# EAGLE schematic nano (EAGLE 7.4.0)
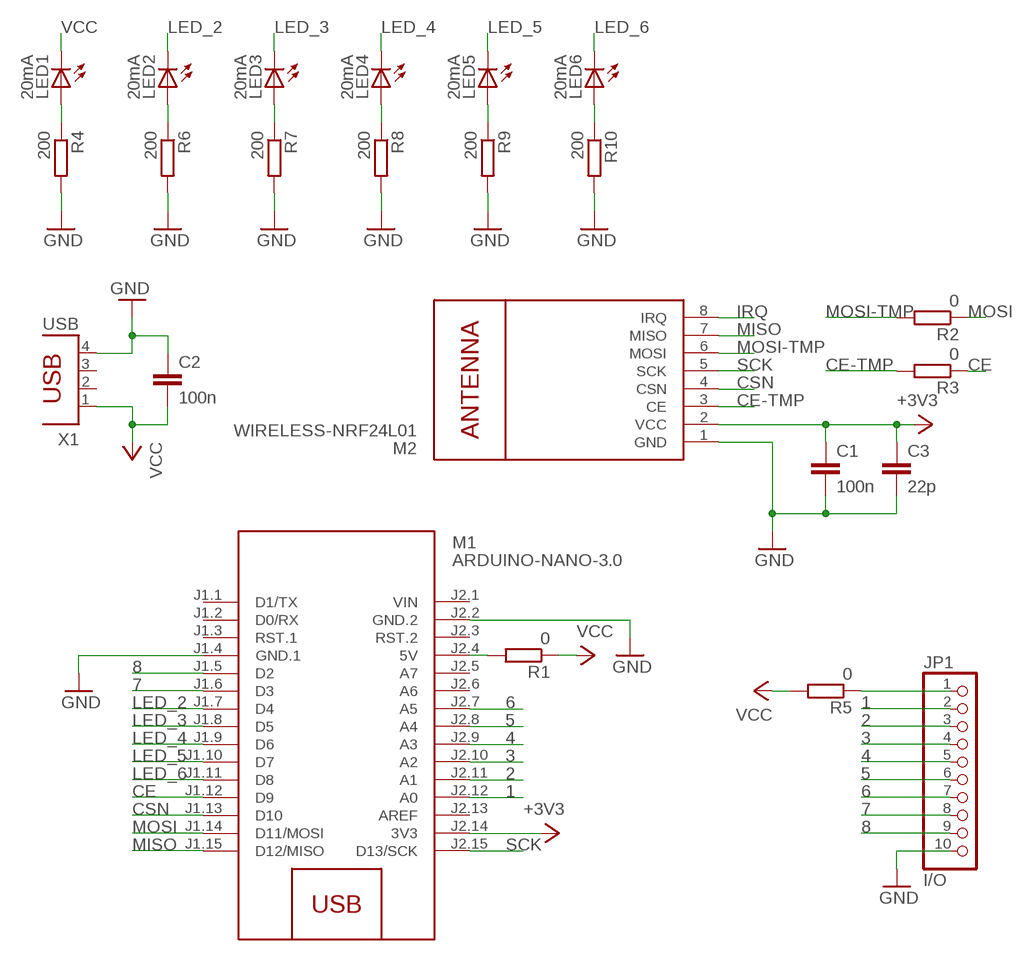
[diagram p0: schematic, sheet 1]

## Parts
C1  100n  C-EUC1206  [C1206]
C2  100n  C-EUC1206  [C1206]
C3  22p  C-EUC1206  [C1206]
JP1  I/O  PINHD-1X10  [1X10]
LED1  20mA  LEDCHIPLED_1206  [CHIPLED_1206]
LED2  20mA  LEDCHIPLED_1206  [CHIPLED_1206]
LED3  20mA  LEDCHIPLED_1206  [CHIPLED_1206]
LED4  20mA  LEDCHIPLED_1206  [CHIPLED_1206]
LED5  20mA  LEDCHIPLED_1206  [CHIPLED_1206]
LED6  20mA  LEDCHIPLED_1206  [CHIPLED_1206]
M1  ARDUINO-NANO-3.0  [ARDUINO-NANO-3.0]
M2  WIRELESS-NRF24L01  [WIRELESS-NRF24L01]
R1  0  R-EU_R1206  [R1206]
R2  0  R-EU_R1206  [R1206]
R3  0  R-EU_R1206  [R1206]
R4  200  R-EU_R1206  [R1206]
R5  0  R-EU_R1206  [R1206]
R6  200  R-EU_R1206  [R1206]
R7  200  R-EU_R1206  [R1206]
R8  200  R-EU_R1206  [R1206]
R9  200  R-EU_R1206  [R1206]
R10  200  R-EU_R1206  [R1206]
X1  USB  PN87520  [PN87520]

## Nets
1: JP1.2 M1.J2.12(A0)
2: JP1.3 M1.J2.11(A1)
3: JP1.4 M1.J2.10(A2)
4: JP1.5 M1.J2.9(A3)
5: JP1.6 M1.J2.8(A4)
6: JP1.7 M1.J2.7(A5)
7: JP1.8 M1.J1.6(D3)
8: JP1.9 M1.J1.5(D2)
+3V3: C1.1 C3.1 M1.J2.14(3V3) M2.2(VCC)
CE: M1.J1.12(D9) R3.1
CE-TMP: M2.3(CE) R3.2
CSN: M1.J1.13(D10) M2.4(CSN)
GND: C1.2 C2.1 C3.2 JP1.10 M1.J1.4(GND.1) M1.J2.2(GND.2) M2.1(GND) R4.2 R6.2 R7.2 R8.2 R9.2 R10.2 X1.4
IRQ: M2.8(IRQ)
LED_2: LED2.C M1.J1.7(D4)
LED_3: LED3.C M1.J1.8(D5)
LED_4: LED4.C M1.J1.9(D6)
LED_5: LED5.C M1.J1.10(D7)
LED_6: LED6.C M1.J1.11(D8)
MISO: M1.J1.15(D12/MISO) M2.7(MISO)
MOSI: M1.J1.14(D11/MOSI) R2.1
MOSI-TMP: M2.6(MOSI) R2.2
N$1: M1.J2.4(5V) R1.2
N$2: LED1.A R4.1
N$3: JP1.1 R5.1
N$4: LED2.A R6.1
N$5: LED3.A R7.1
N$6: LED4.A R8.1
N$7: LED5.A R9.1
N$9: LED6.A R10.1
SCK: M1.J2.15(D13/SCK) M2.5(SCK)
VCC: C2.2 LED1.C R1.1 R5.2 X1.1
Unconnected: M1.J1.1(D1/TX) M1.J1.2(D0/RX) M1.J1.3(RST.1) M1.J2.3(RST.2) M1.J2.5(A7) M1.J2.6(A6) M1.J2.13(AREF) X1.2 X1.3

## Power pins joined to a net without a drawn wire
VIN: M1.J2.1(VIN)

## Library data of the parts
C1-C3 = rcl:C-EU: CAPACITOR, European symbol
JP1 = pinhead:PINHD-1X10: PIN HEADER
LED1-LED6 = led:LED: LED OSRAM: - CHIPLED LG R971, LG N971, LY N971, LG Q971, LY Q971, LO R971, LY R971 LH N974, LH R974 LS Q976, LO Q976, LY Q976 LO Q996 - Hyper CHIPLED LW Q18S LB Q993, LB Q99A, LB R99A - SideLED LS A670, LO A670, LY A670, LG A670, LP A670 LB A673, LV A673, LT A673, LW A673 LH A674 LY A675 LS A676, LA A676, LO A676, LY A676, LW A676 LS A679, LY A679, LG A679 - Hyper Micro SIDELED® LS Y876, LA Y876, LO Y876, LY Y876 LT Y87S - SmartLED LW L88C, LW L88S LB L89C, LB L89S, LG L890 LS L89K, LO L89K, LY L89K LS L896, LA L896, LO L896, LY L896 - TOPLED LS T670, LO T670, LY T670, LG T670, LP T670 LSG T670, LSP T670, LSY T670, LOP T670, LYG T670 LG T671, LOG T671, LSG T671 LB T673, LV T673, LT T673, LW T673 LH T674 LS T676, LA T676, LO T676, LY T676, LB T676, LH T676, LSB T676, LW T676 LB T67C, LV T67C, LT T67C, LS T67K, LO T67K, LY T67K, LW E67C LS E67B, LA E67B, LO E67B, LY E67B, LB E67C, LV E67C, LT E67C LW T67C LS T679, LY T679, LG T679 LS T770, LO T770, LY T770, LG T770, LP T770 LB T773, LV T773, LT T773, LW T773 LH T774 LS E675, LA E675, LY E675, LS T675 LS T776, LA T776, LO T776, LY T776, LB T776 LHGB T686 LT T68C, LB T68C - Hyper Mini TOPLED® LB M676 - Mini TOPLED Santana® LG M470 LS M47K, LO M47K, LY M47K Source: http://www.osram.convergy.de LUXEON: - LUMILED® LXK2-PW12-R00, LXK2-PW12-S00, LXK2-PW14-U00, LXK2-PW14-V00 LXK2-PM12-R00, LXK2-PM12-S00, LXK2-PM14-U00 LXK2-PE12-Q00, LXK2-PE12-R00, LXK2-PE12-S00, LXK2-PE14-T00, LXK2-PE14-U00 LXK2-PB12-K00, LXK2-PB12-L00, LXK2-PB12-M00, LXK2-PB14-N00, LXK2-PB14-P00, LXK2-PB14-Q00 LXK2-PR12-L00, LXK2-PR12-M00, LXK2-PR14-Q00, LXK2-PR14-R00 LXK2-PD12-Q00, LXK2-PD12-R00, LXK2-PD12-S00 LXK2-PH12-R00, LXK2-PH12-S00 LXK2-PL12-P00, LXK2-PL12-Q00, LXK2-PL12-R00 Source: www.luxeon.com KINGBRIGHT: KA-3528ASYC Source: www.kingbright.com
M1 = diy-modules:ARDUINO-NANO-3.0: Arduino Nano 3.0
M2 = diy-modules:WIRELESS-NRF24L01: 2.4 GHz Wireless Module based on NRF24L01 chip
R1-R10 = rcl:R-EU_: RESISTOR, European symbol
X1 = con-berg:PN87520: BERG USB connector; OC_FARNELL: unknown; OC_NEWARK: unknown

## Net classes
0 default: clearance 0.305 mm